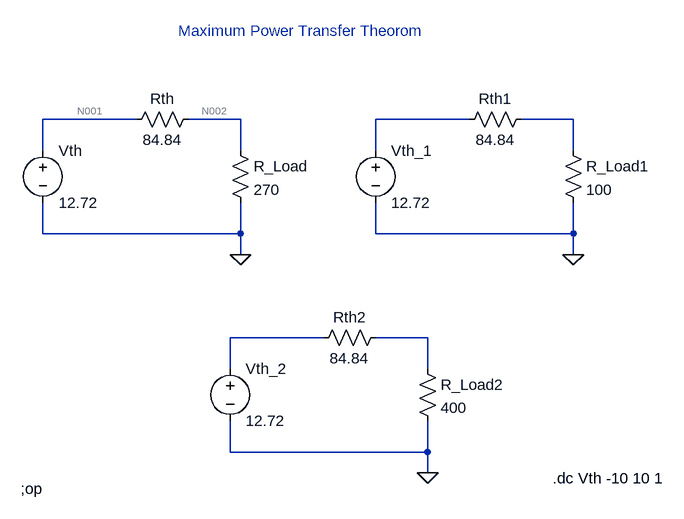
[diagram p0: schematic EEE_1_5.asc]
EEE_1_5.asc, the LTspice schematic file:
Version 4
SHEET 1 1036 680
WIRE 208 64 64 64
WIRE 368 64 288 64
WIRE 720 64 576 64
WIRE 880 64 800 64
WIRE 64 112 64 64
WIRE 368 112 368 64
WIRE 576 112 576 64
WIRE 880 112 880 64
WIRE 64 240 64 192
WIRE 368 240 368 192
WIRE 368 240 64 240
WIRE 576 240 576 192
WIRE 880 240 880 192
WIRE 880 240 576 240
WIRE 368 272 368 240
WIRE 880 272 880 240
WIRE 496 400 352 400
WIRE 656 400 576 400
WIRE 352 448 352 400
WIRE 656 448 656 400
WIRE 352 576 352 528
WIRE 656 576 656 528
WIRE 656 576 352 576
WIRE 656 608 656 576
FLAG 368 272 0
FLAG 880 272 0
FLAG 656 608 0
SYMBOL voltage 64 96 R0
WINDOW 123 0 0 Left 0
WINDOW 39 0 0 Left 0
SYMATTR InstName Vth
SYMATTR Value 12.72
SYMBOL res 304 48 R90
WINDOW 0 0 56 VBottom 2
WINDOW 3 32 56 VTop 2
SYMATTR InstName Rth
SYMATTR Value 84.84
SYMBOL res 352 96 R0
SYMATTR InstName R_Load
SYMATTR Value 270
SYMBOL voltage 576 96 R0
WINDOW 123 0 0 Left 0
WINDOW 39 0 0 Left 0
SYMATTR InstName Vth_1
SYMATTR Value 12.72
SYMBOL res 816 48 R90
WINDOW 0 0 56 VBottom 2
WINDOW 3 32 56 VTop 2
SYMATTR InstName Rth1
SYMATTR Value 84.84
SYMBOL res 864 96 R0
SYMATTR InstName R_Load1
SYMATTR Value 100
SYMBOL voltage 352 432 R0
WINDOW 123 0 0 Left 0
WINDOW 39 0 0 Left 0
SYMATTR InstName Vth_2
SYMATTR Value 12.72
SYMBOL res 592 384 R90
WINDOW 0 0 56 VBottom 2
WINDOW 3 32 56 VTop 2
SYMATTR InstName Rth2
SYMATTR Value 84.84
SYMBOL res 640 432 R0
SYMATTR InstName R_Load2
SYMATTR Value 400
TEXT 30 632 Left 2 !;op
TEXT 272 -72 Left 2 ;Maximum Power Transfer Theorom
TEXT 848 616 Left 2 !.dc Vth -10 10 1

The netlist it stands for:
* EEE_1_5.asc
Vth N001 0 12.72
Rth N002 N001 84.84
R_Load N002 0 270
Vth_1 N003 0 12.72
Rth1 N004 N003 84.84
R_Load1 N004 0 100
Vth_2 N005 0 12.72
Rth2 N006 N005 84.84
R_Load2 N006 0 400
;op
* Maximum Power Transfer Theorom
.dc Vth -10 10 1
.backanno
.end

* Results of the author's LTspice run, read from the files saved beside the schematic
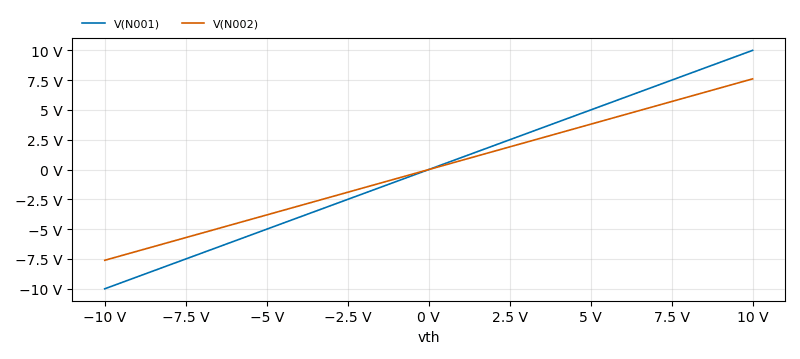
[diagram p1: DC transfer characteristic of EEE_1_5.asc, plotted from the saved traces]
* DC transfer characteristic, 1 run:
*   V(N001): -10 V at vth=-10 V, 10 V at vth=10 V, min -10 V, max 10 V
*   V(N002): -7.609 V at vth=-10 V, 7.609 V at vth=10 V, min -7.609 V, max 7.609 V